# EAGLE design untitled (EAGLE 9.6.2)
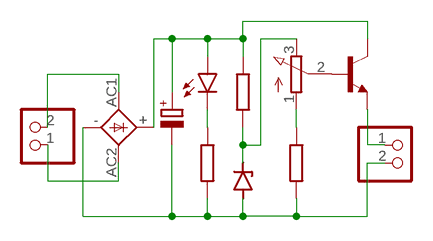
[diagram p0: schematic, sheet 1]

## Parts
1N47430_13V_1W  1N4728  [DO41Z10]
B5K_1W  B5K  3RP/1610N  [3RP/1610N]
BD137_60V_1.5A  BC547  [TO92]
CR25_2000OHM  2k  R-EU_0207/10  [0207/10]
CR25_2700OHM  2.7k  R-EU_0207/10  [0207/10]
CR25_6800OHM  6.8k  R-EU_0207/10  [0207/10]
ELCO_680UF_25V  680 uF  CPOL-EUE5-10.5  [E5-10,5]
IN  In  PINHD-1X2  [1X02]
KBP206_2A_600V_TOWER  2A 600V  1KAB  [1KAB]
LED_VERMELHO  LedR  LED5MM  [LED5MM]
OUT  Out  PINHD-1X2  [1X02]

## Nets
N$1: IN.2 KBP206_2A_600V_TOWER.AC1
N$2: IN.1 KBP206_2A_600V_TOWER.AC2
N$3: BD137_60V_1.5A.3(C) CR25_2700OHM.1 ELCO_680UF_25V.+ KBP206_2A_600V_TOWER.+ LED_VERMELHO.A
N$4: 1N47430_13V_1W.A CR25_2000OHM.2 CR25_6800OHM.2 ELCO_680UF_25V.- KBP206_2A_600V_TOWER.- OUT.2
N$5: CR25_6800OHM.1 LED_VERMELHO.K(C)
N$6: 1N47430_13V_1W.C B5K_1W.3(E) CR25_2700OHM.2
N$7: B5K_1W.2(S) BD137_60V_1.5A.2(B)
N$8: B5K_1W.1(A) CR25_2000OHM.1
N$9: BD137_60V_1.5A.1(E) OUT.1

## Library data of the parts
1N47430_13V_1W = diode:1N4728: Z DIODE 3.3 V, 1W, 5 percent
B5K_1W = pot:3RP/1610N: 16mm Potentiometer one level Source: http://www.alphapotentiometers.net/html/16mm_pot_2.html
BD137_60V_1.5A = transistor:BC547: NPN TRANSISTOR
CR25_2000OHM CR25_2700OHM CR25_6800OHM = rcl:R-EU_: RESISTOR, European symbol; SPICEPREFIX: R
ELCO_680UF_25V = rcl:CPOL-EU: POLARIZED CAPACITOR, European symbol; SPICEPREFIX: C
IN OUT = pinhead:PINHD-1X2: PIN HEADER
KBP206_2A_600V_TOWER = rectifier:1KAB: RECTIFIER grid 5,08 x 5,08 mm
LED_VERMELHO = led:LED: LED OSRAM: - CHIPLED LG R971, LG N971, LY N971, LG Q971, LY Q971, LO R971, LY R971 LH N974, LH R974 LS Q976, LO Q976, LY Q976 LO Q996 - Hyper CHIPLED LW Q18S LB Q993, LB Q99A, LB R99A - SideLED LS A670, LO A670, LY A670, LG A670, LP A670 LB A673, LV A673, LT A673, LW A673 LH A674 LY A675 LS A676, LA A676, LO A676, LY A676, LW A676 LS A679, LY A679, LG A679 - Hyper Micro SIDELED® LS Y876, LA Y876, LO Y876, LY Y876 LT Y87S - SmartLED LW L88C, LW L88S LB L89C, LB L89S, LG L890 LS L89K, LO L89K, LY L89K LS L896, LA L896, LO L896, LY L896 - TOPLED LS T670, LO T670, LY T670, LG T670, LP T670 LSG T670, LSP T670, LSY T670, LOP T670, LYG T670 LG T671, LOG T671, LSG T671 LB T673, LV T673, LT T673, LW T673 LH T674 LS T676, LA T676, LO T676, LY T676, LB T676, LH T676, LSB T676, LW T676 LB T67C, LV T67C, LT T67C, LS T67K, LO T67K, LY T67K, LW E67C LS E67B, LA E67B, LO E67B, LY E67B, LB E67C, LV E67C, LT E67C LW T67C LS T679, LY T679, LG T679 LS T770, LO T770, LY T770, LG T770, LP T770 LB T773, LV T773, LT T773, LW T773 LH T774 LS E675, LA E675, LY E675, LS T675 LS T776, LA T776, LO T776, LY T776, LB T776 LHGB T686 LT T68C, LB T68C - Hyper Mini TOPLED® LB M676 - Mini TOPLED Santana® LG M470 LS M47K, LO M47K, LY M47K Source: http://www.osram.convergy.de LUXEON: - LUMILED® LXK2-PW12-R00, LXK2-PW12-S00, LXK2-PW14-U00, LXK2-PW14-V00 LXK2-PM12-R00, LXK2-PM12-S00, LXK2-PM14-U00 LXK2-PE12-Q00, LXK2-PE12-R00, LXK2-PE12-S00, LXK2-PE14-T00, LXK2-PE14-U00 LXK2-PB12-K00, LXK2-PB12-L00, LXK2-PB12-M00, LXK2-PB14-N00, LXK2-PB14-P00, LXK2-PB14-Q00 LXK2-PR12-L00, LXK2-PR12-M00, LXK2-PR14-Q00, LXK2-PR14-R00 LXK2-PD12-Q00, LXK2-PD12-R00, LXK2-PD12-S00 LXK2-PH12-R00, LXK2-PH12-S00 LXK2-PL12-P00, LXK2-PL12-Q00, LXK2-PL12-R00 Source: www.luxeon.com KINGBRIGHT: KA-3528ASYC Source: www.kingbright.com

## Board
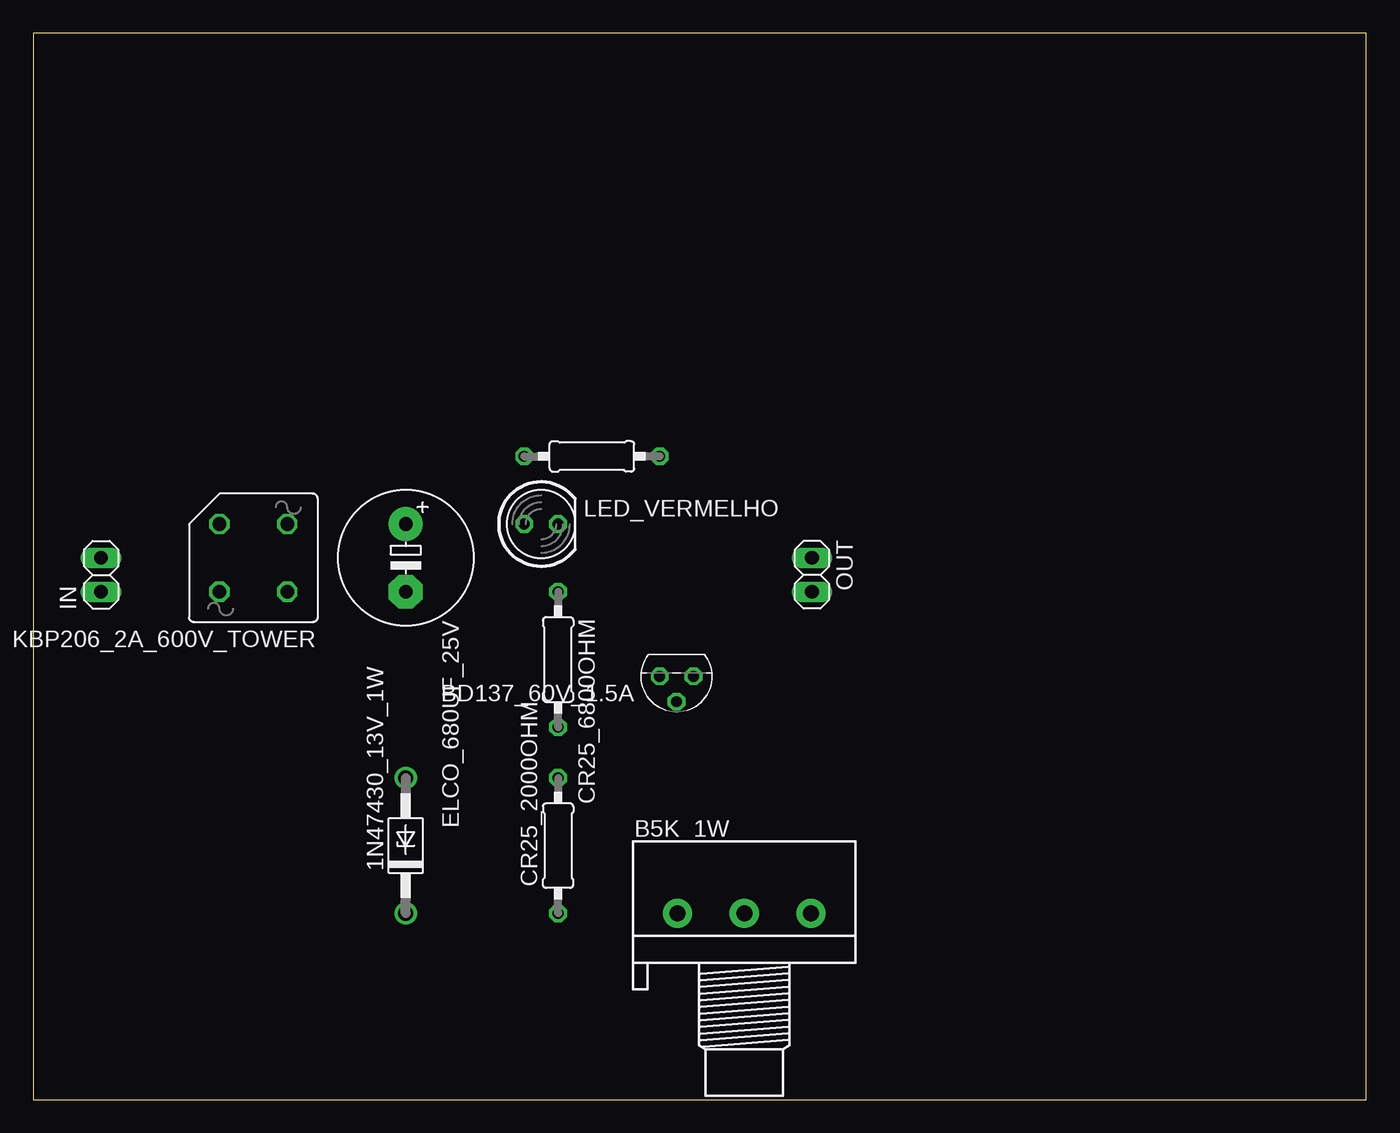
[diagram p1: board, top side]
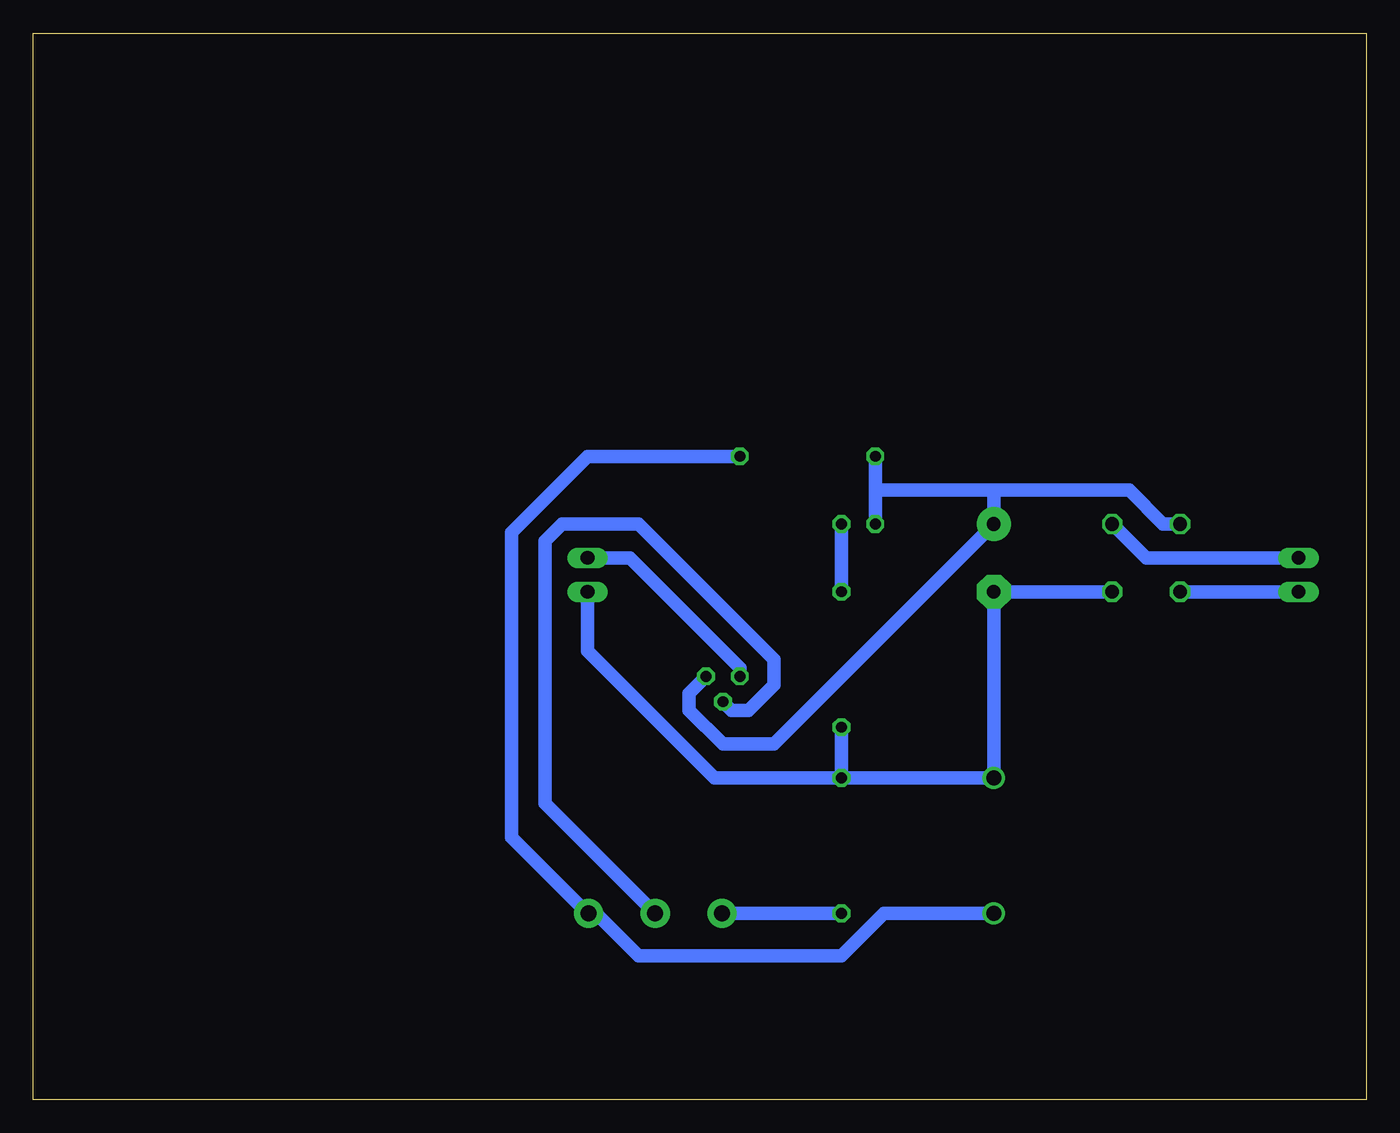
[diagram p2: board, bottom side, seen from below]

Size 100 x 80 mm. Coordinates in mm from the lower left corner, seen from the top.
Outline: 0,0 100,0 100,80 0,80 0,0
Copper layers (1*16): Top 0.035mm / dielectric 1.5mm / Bottom 0.035mm
Design rules "default *": minimum track width 40mil, minimum drill 0.35mm, track to track 40mil, track to pad 40mil, pad to pad 40mil, via to via 6mil, smd to smd 6mil, copper to edge 6mil, drill to drill 6mil, minimum pad ring 10mil, minimum via ring 8mil, stop-mask expansion 4mil, vias tented up to drill 0mil, thermal gap 10mil

### Footprints (pad centres in the part's own frame; a part is rotated, then mirrored left to right if it is on the bottom)
DO41Z10 = drill 1.118: A 5.08,0; C -5.08,0
3RP/1610N = drill 1.2 pad 2.184: 1 -5,0; 2 0,0; 3 5,0
TO92 = drill 0.813 octagon: 1 1.27,0; 2 0,1.905; 3 -1.27,0
0207/10 = drill 0.813 octagon: 1 -5.08,0; 2 5.08,0
E5-10,5 = drill 1.016 pad 2.54: + -2.54,0 | drill 1.016 pad 2.54 octagon: - 2.54,0
1X02 = drill 1.016 long: 1 -1.27,0; 2 1.27,0
1KAB = drill 1.016 octagon: + 2.54,-2.54; - -2.54,2.54; AC1 -2.54,-2.54; AC2 2.54,2.54
LED5MM = drill 0.813 octagon: A -1.27,0; K 1.27,0

### Placement (x,y rotation side)
1N47430_13V_1W  27.94,19.05 90 top
B5K_1W  53.34,13.97 0 top
BD137_60V_1.5A  48.26,31.75 180 top
CR25_2000OHM  39.37,19.05 90 top
CR25_2700OHM  41.91,48.26 0 top
CR25_6800OHM  39.37,33.02 270 top
ELCO_680UF_25V  27.94,40.64 270 top
IN  5.08,39.37 90 top
KBP206_2A_600V_TOWER  16.51,40.64 180 top
LED_VERMELHO  38.1,43.18 0 top
OUT  58.42,39.37 270 top

### Tracks (layer width: path | path; a pad name or v marks a point on that pad's centre or on a via)
N$1
  Bottom 1.016: IN.2 16.51,40.64 KBP206_2A_600V_TOWER.AC1
N$2
  Bottom 1.016: KBP206_2A_600V_TOWER.AC2 IN.1
N$3
  Bottom 1.016: CR25_2700OHM.1 36.83,45.72 | 36.83,45.72 LED_VERMELHO.A | KBP206_2A_600V_TOWER.+ 15.24,43.18 17.78,45.72 27.94,45.72 | 36.83,45.72 27.94,45.72 | BD137_60V_1.5A.3 50.8,30.48 50.8,29.21 48.26,26.67 44.45,26.67 ELCO_680UF_25V.+ 27.94,45.72
N$4
  Bottom 1.016: KBP206_2A_600V_TOWER.- ELCO_680UF_25V.- 1N47430_13V_1W.A CR25_2000OHM.2 | CR25_6800OHM.2 CR25_2000OHM.2 | OUT.2 58.42,33.66 48.9,24.13 CR25_2000OHM.2
N$5
  Bottom 1.016: LED_VERMELHO.K CR25_6800OHM.1
N$6
  Bottom 1.016: CR25_2700OHM.2 58.42,48.26 64.14,42.55 64.14,19.68 58.42,13.97 B5K_1W.3 57.78,13.97 54.61,10.79 39.37,10.79 36.2,13.97 1N47430_13V_1W.C
N$7
  Bottom 1.016: BD137_60V_1.5A.2 47.62,29.21 46.35,29.21 44.45,31.11 44.45,33.02 54.61,43.18 60.33,43.18 61.59,41.91 61.59,22.23 B5K_1W.2
N$8
  Bottom 1.016: B5K_1W.1 CR25_2000OHM.1
N$9
  Bottom 1.016: BD137_60V_1.5A.1 46.99,32.38 55.24,40.64 OUT.1